# Altium project FPC2DFPC.PrjPCB
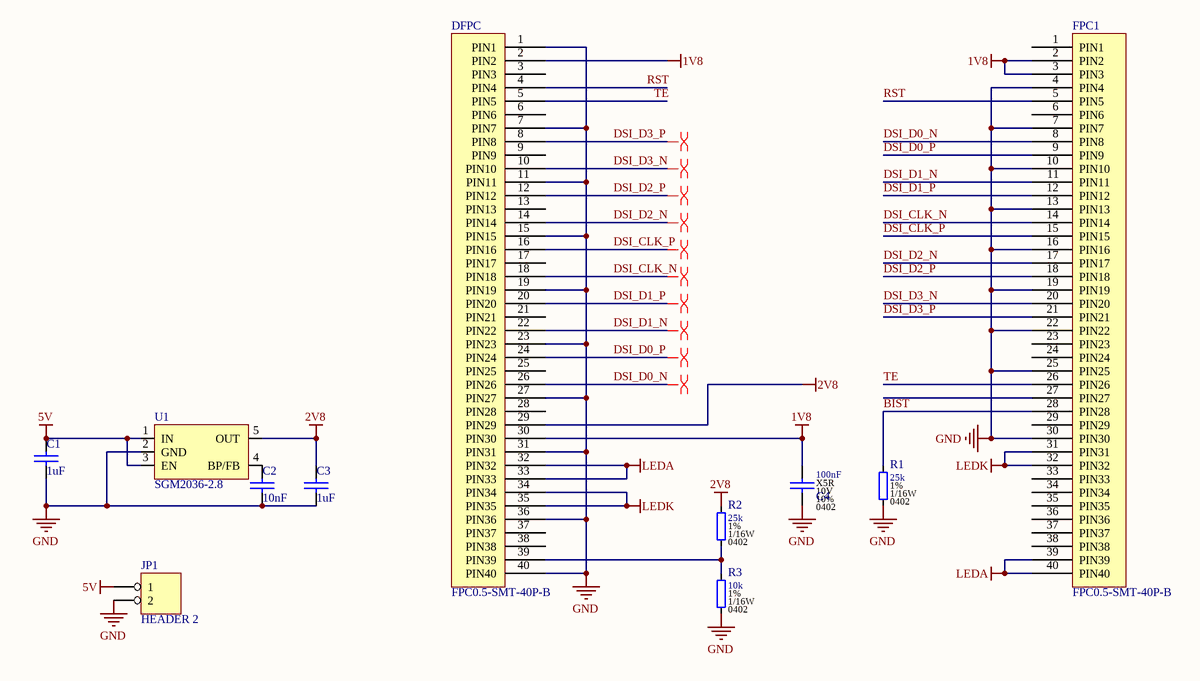
[diagram p0: FPC2DFPC.SchDoc]
1 sheet, 11 parts. Net scope: global (net labels, ports and power ports of the same name join across sheets).
Board file: FPC2DFPC.PcbDoc

## Sheet FPC2DFPC.SchDoc
size A4

### Parts
C1  1uF  [0402_CAP_SMT]
C2  10nF  [0402_CAP_SMT]
C3  1uF  [0402_CAP_SMT]
C4  value 100nF  Dielectric: X5R  Voltage: 10V  Footprint: 0402  Tolerance: 10%  [0402_CAP_SMT]  (hidden comment: CAP)
DFPC  FPC0.5-SMT-40P-B  [DFPC]
FPC1  FPC0.5-SMT-40P-B  [FPC0.5-SMT-40P-B]
JP1  HEADER 2  [2PIN_125MM_SMT_VERTICAL]
R1  value 25k  Footprint: 0402  Tolerance: 1%  Wattage: 1/16W  [0402_RES_SMT]  (hidden comment: RES)
R2  value 25k  Footprint: 0402  Tolerance: 1%  Wattage: 1/16W  [0402_RES_SMT]  (hidden comment: RES)
R3  value 10k  Footprint: 0402  Tolerance: 1%  Wattage: 1/16W  [0402_RES_SMT]  (hidden comment: RES)
U1  SGM2036-2.8  [SOT23-5]

### Nets
1V8: C4.1 DFPC.2(PIN2) DFPC.30(PIN30) FPC1.2(PIN2) FPC1.3(PIN3)
2V8: C3.1 DFPC.29(PIN29) R2.1 U1.5(OUT)
5V: C1.1 JP1.1 U1.1(IN) U1.3(EN)
GND: C1.2 C2.2 C3.2 C4.2 DFPC.1(PIN1) DFPC.7(PIN7) DFPC.11(PIN11) DFPC.15(PIN15) DFPC.19(PIN19) DFPC.23(PIN23) DFPC.27(PIN27) DFPC.31(PIN31) DFPC.36(PIN36) DFPC.40(PIN40) FPC1.4(PIN4) FPC1.7(PIN7) FPC1.10(PIN10) FPC1.13(PIN13) FPC1.16(PIN16) FPC1.19(PIN19) FPC1.22(PIN22) FPC1.25(PIN25) FPC1.30(PIN30) JP1.2 R1.2 R3.2 U1.2(GND)
LEDA: DFPC.32(PIN32) DFPC.33(PIN33) FPC1.39(PIN39) FPC1.40(PIN40)
LEDK: DFPC.34(PIN34) DFPC.35(PIN35) FPC1.31(PIN31) FPC1.32(PIN32)
BIST: FPC1.28(PIN28) R1.1
DSI_CLK_N: DFPC.18(PIN18) FPC1.14(PIN14)
DSI_CLK_P: DFPC.16(PIN16) FPC1.15(PIN15)
DSI_D0_N: DFPC.26(PIN26) FPC1.8(PIN8)
DSI_D0_P: DFPC.24(PIN24) FPC1.9(PIN9)
DSI_D1_N: DFPC.22(PIN22) FPC1.11(PIN11)
DSI_D1_P: DFPC.20(PIN20) FPC1.12(PIN12)
DSI_D2_N: DFPC.14(PIN14) FPC1.17(PIN17)
DSI_D2_P: DFPC.12(PIN12) FPC1.18(PIN18)
DSI_D3_N: DFPC.10(PIN10) FPC1.20(PIN20)
DSI_D3_P: DFPC.8(PIN8) FPC1.21(PIN21)
RST: DFPC.4(PIN4) FPC1.5(PIN5)
TE: DFPC.5(PIN5) FPC1.26(PIN26)
NetC2_1: C2.1 U1.4(BP/FB)
NetDFPC_39: DFPC.39(PIN39) R2.2 R3.1

Not connected (* = marked no-connect by the designer): DFPC 3(PIN3) 6(PIN6) 9(PIN9) 13(PIN13) 17(PIN17) 21(PIN21) 25(PIN25) 28(PIN28) 37(PIN37) 38(PIN38); FPC1 1(PIN1) 6(PIN6) 23(PIN23) 24(PIN24) 27(PIN27) 29(PIN29) 33(PIN33) 34(PIN34) 35(PIN35) 36(PIN36) 37(PIN37) 38(PIN38)

### Layout directives
differential pair: DSI_CLK_N, DSI_CLK_P, DSI_D0_N, DSI_D0_P, DSI_D1_N, DSI_D1_P, DSI_D2_N, DSI_D2_P, DSI_D3_N, DSI_D3_P

### Library data of the parts
C1-C4 = CAP: 陶瓷电容
R1-R3 = RES: 贴片电阻
U1 = SGM2036: LDO